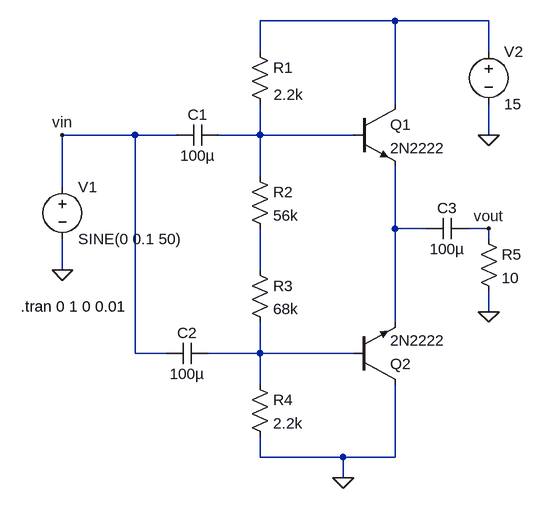
[diagram p0: schematic b amp.asc]
b amp.asc, the LTspice schematic file:
Version 4
SHEET 1 1112 680
WIRE 400 -320 192 -320
WIRE 544 -320 400 -320
WIRE 192 -272 192 -320
WIRE 544 -272 544 -320
WIRE 400 -192 400 -320
WIRE 0 -144 -112 -144
WIRE 64 -144 0 -144
WIRE 192 -144 192 -192
WIRE 192 -144 128 -144
WIRE 336 -144 192 -144
WIRE 544 -144 544 -192
WIRE 192 -80 192 -144
WIRE -112 -64 -112 -144
WIRE 400 0 400 -96
WIRE 448 0 400 0
WIRE 544 0 512 0
WIRE 544 16 544 0
WIRE -112 64 -112 16
WIRE 192 64 192 0
WIRE 544 128 544 96
WIRE 400 144 400 0
WIRE 0 192 0 -144
WIRE 48 192 0 192
WIRE 192 192 192 144
WIRE 192 192 112 192
WIRE 336 192 192 192
WIRE 192 240 192 192
WIRE 192 352 192 320
WIRE 320 352 192 352
WIRE 400 352 400 240
WIRE 400 352 320 352
WIRE 320 384 320 352
FLAG 544 128 0
FLAG 320 384 0
FLAG 544 -144 0
FLAG -112 64 0
FLAG -112 -144 vin
FLAG 544 0 vout
SYMBOL voltage -112 -80 R0
WINDOW 123 0 0 Left 0
WINDOW 39 0 0 Left 0
SYMATTR InstName V1
SYMATTR Value SINE(0 0.1 50)
SYMBOL cap 128 -160 R90
WINDOW 0 0 32 VBottom 2
WINDOW 3 32 32 VTop 2
SYMATTR InstName C1
SYMATTR Value 100µ
SYMBOL res 176 -288 R0
WINDOW 3 37 82 Left 2
SYMATTR Value 2.2k
SYMATTR InstName R1
SYMBOL res 176 -96 R0
SYMATTR InstName R2
SYMATTR Value 56k
SYMBOL npn 336 -192 R0
SYMATTR InstName Q1
SYMATTR Value 2N2222
SYMBOL res 176 48 R0
SYMATTR InstName R3
SYMATTR Value 68k
SYMBOL res 528 0 R0
SYMATTR InstName R5
SYMATTR Value 10
SYMBOL cap 112 176 R90
WINDOW 0 0 32 VBottom 2
WINDOW 3 32 32 VTop 2
SYMATTR InstName C2
SYMATTR Value 100µ
SYMBOL voltage 544 -288 R0
WINDOW 123 0 0 Left 0
WINDOW 39 0 0 Left 0
SYMATTR InstName V2
SYMATTR Value 15
SYMBOL res 176 224 R0
SYMATTR InstName R4
SYMATTR Value 2.2k
SYMBOL npn 336 240 M180
SYMATTR InstName Q2
SYMATTR Value 2N2222
SYMBOL cap 512 -16 R90
WINDOW 0 0 32 VBottom 2
WINDOW 3 32 32 VTop 2
SYMATTR InstName C3
SYMATTR Value 100µ
TEXT -176 120 Left 2 !.tran 0 1 0 0.01

The netlist it stands for:
* b amp.asc
V1 vin 0 SINE(0 0.1 50)
C1 N002 vin 100µ
R1 N001 N002 2.2k
R2 N002 N004 56k
Q1 N001 N002 N003 0 2N2222
R3 N004 N005 68k
R5 vout 0 10
C2 N005 vin 100µ
V2 N001 0 15
R4 N005 0 2.2k
Q2 0 N005 N003 0 2N2222
C3 vout N003 100µ
.model NPN NPN
.model PNP PNP
.lib standard.bjt
.tran 0 1 0 0.01
.backanno
.end